# Altium project PCB_mezzanine_analog_template .PrjPCB
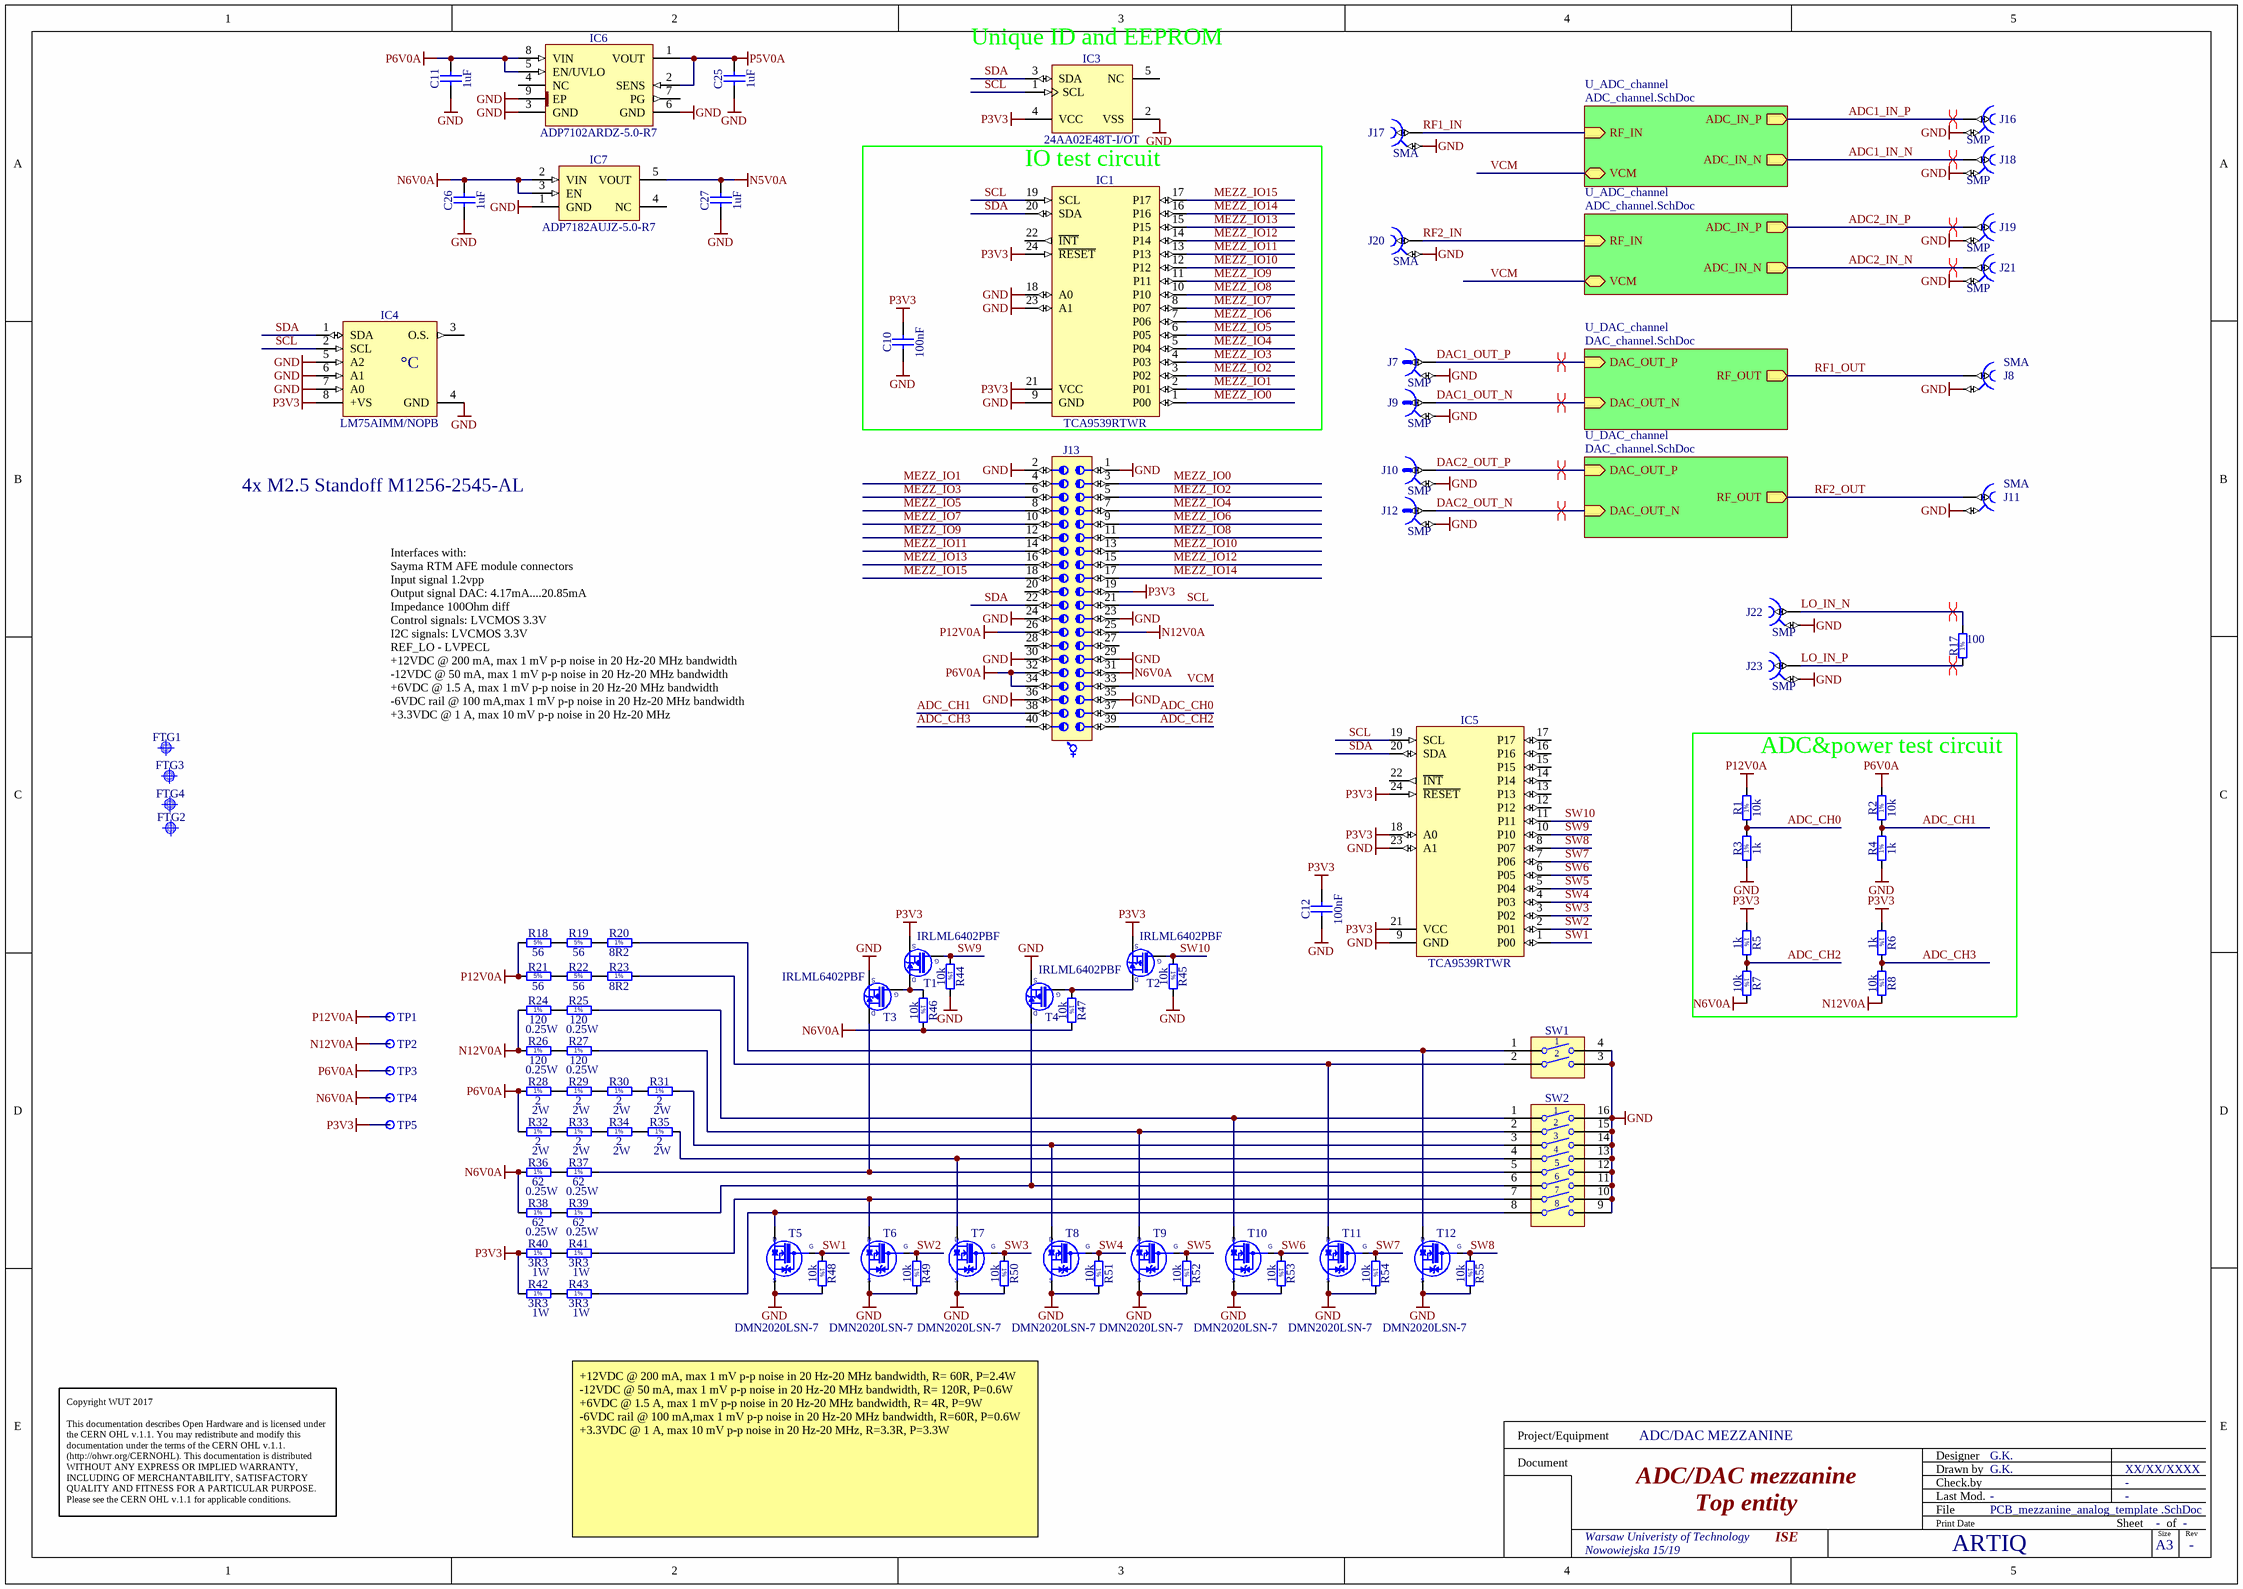
[diagram p0: PCB_mezzanine_analog_template .SchDoc]
3 sheets, 137 parts. Net scope: hierarchical (ports join the sheet entries above them; power ports are global).
Board file: PCB_mezzanine_analog_template.PcbDoc
Sheets:
  PCB_mezzanine_analog_template .SchDoc
    U_ADC_channel = ADC_channel.SchDoc
    U_DAC_channel = DAC_channel.SchDoc
    U_ADC_channel = ADC_channel.SchDoc
    U_DAC_channel = DAC_channel.SchDoc

## Sheet PCB_mezzanine_analog_template .SchDoc: ADC/DAC mezzanine
size 420 x 297 mm; Author: G.K.; CompanyName: WUT; DrawnBy: G.K.; Organization: CERN; Address1: Warsaw Univeristy of Technology; Address2: Nowowiejska 15/19; Revision: -; SheetNumber: -; SheetTotal: -; EDA_Number: ARTIQ; Projet: ADC/DAC MEZZANINE; ModifiedBy: -; CreateDate: XX/XX/XXXX; CheckedDate: -; Title2: Top entity; DivGrp: ISE; Designer: G.K.; ModifiedDate: -; ProjectName: ADC/DAC MEZZANINE

### Parts
C10  100nF  [CAPC1005X55N]
C11  1uF  [CAPC2012X140N]
C12  100nF  [CAPC1005X55N]
C25  1uF  [CAPC2012X140N]
C26  1uF  [CAPC2012X140N]
C27  1uF  [CAPC2012X140N]
FTG1  Use only in PCB  [FIDUCIAL_TOP_C100-200]  (value not drawn)
FTG2  Use only in PCB  [FIDUCIAL_TOP_S100-200]  (value not drawn)
FTG3  Use only in PCB  [FIDUCIAL_TOP_S100-200]  (value not drawn)
FTG4  Use only in PCB  [FIDUCIAL_TOP_S200-400]  (value not drawn)
IC1  TCA9539RTWR  [QFN50P400X400X80-25N-S255]
IC3  24AA02E48T-I/OT  [SOT95P280X145-5N]
IC4  LM75AIMM/NOPB  [SOP65P490X109-8N]
IC5  TCA9539RTWR  [QFN50P400X400X80-25N-S255]
IC6  ADP7102ARDZ-5.0-R7  [SOIC127P600X175-9N-R241X309]
IC7  ADP7182AUJZ-5.0-R7  [SOT95P280X90-5N]
J7  SMP  [MOLEX_85305-0232]
J8  SMA  [TELEGARTNER_J01151A0451]
J9  SMP  [MOLEX_85305-0232]
J10  SMP  [MOLEX_85305-0232]
J11  SMA  [TELEGARTNER_J01151A0451]
J12  SMP  [MOLEX_85305-0232]
J13  (no value)  [SAMTEC_LSS-120-02-L-DV-A]
J16  SMP  [AMPHENOL_SMP-MSLD-PCT-10]
J17  SMA  [TELEGARTNER_J01151A0921]
J18  SMP  [AMPHENOL_SMP-MSLD-PCT-10]
J19  SMP  [AMPHENOL_SMP-MSLD-PCT-10]
J20  SMA  [TELEGARTNER_J01151A0921]
J21  SMP  [AMPHENOL_SMP-MSLD-PCT-10]
J22  SMP  [AMPHENOL_SMP-MSLD-PCT-10]
J23  SMP  [AMPHENOL_SMP-MSLD-PCT-10]
R1  10k  [RESC1005X40N]
R2  10k  [RESC1005X40N]
R3  1k  [RESC1005X40N]
R4  1k  [RESC1005X40N]
R5  1k  [RESC1005X40N]
R6  1k  [RESC1005X40N]
R7  10k  [RESC1005X40N]
R8  10k  [RESC1005X40N]
R17  100  [RESC1005X40N]
R18  56  [RESC6331X70N]
R19  56  [RESC6331X70N]
R20  8R2  [RESC3216X65N]
R21  56  [RESC6331X70N]
R22  56  [RESC6331X70N]
R23  8R2  [RESC3216X65N]
R24  120  Power: 0.25W  [RESC3216X65N]
R25  120  Power: 0.25W  [RESC3216X65N]
R26  120  Power: 0.25W  [RESC3216X65N]
R27  120  Power: 0.25W  [RESC3216X65N]
R28  2  Power: 2W  [RESM11670X449N]
R29  2  Power: 2W  [RESM11670X449N]
R30  2  Power: 2W  [RESM11670X449N]
R31  2  Power: 2W  [RESM11670X449N]
R32  2  Power: 2W  [RESM11670X449N]
R33  2  Power: 2W  [RESM11670X449N]
R34  2  Power: 2W  [RESM11670X449N]
R35  2  Power: 2W  [RESM11670X449N]
R36  62  Power: 0.25W  [RESC3216X65N]
R37  62  Power: 0.25W  [RESC3216X65N]
R38  62  Power: 0.25W  [RESC3216X65N]
R39  62  Power: 0.25W  [RESC3216X65N]
R40  3R3  Power: 1W  [RESC6331X70N]
R41  3R3  Power: 1W  [RESC6331X70N]
R42  3R3  Power: 1W  [RESC6331X70N]
R43  3R3  Power: 1W  [RESC6331X70N]
R44  10k  [RESC1005X40N]
R45  10k  [RESC1005X40N]
R46  10k  [RESC1005X40N]
R47  10k  [RESC1005X40N]
R48  10k  [RESC1005X40N]
R49  10k  [RESC1005X40N]
R50  10k  [RESC1005X40N]
R51  10k  [RESC1005X40N]
R52  10k  [RESC1005X40N]
R53  10k  [RESC1005X40N]
R54  10k  [RESC1005X40N]
R55  10k  [RESC1005X40N]
SW1  Switch  [SW_OMRON_A6S-2102-H]  (value not drawn)
SW2  Switch  [SW_OMRON_A6S-8102-H]  (value not drawn)
T1  IRLML6402PBF  [SOT95P237X112-3N]
T2  IRLML6402PBF  [SOT95P237X112-3N]
T3  IRLML6402PBF  [SOT95P237X112-3N]
T4  IRLML6402PBF  [SOT95P237X112-3N]
T5  DMN2020LSN-7  [SOT95P285X140-3N]
T6  DMN2020LSN-7  [SOT95P285X140-3N]
T7  DMN2020LSN-7  [SOT95P285X140-3N]
T8  DMN2020LSN-7  [SOT95P285X140-3N]
T9  DMN2020LSN-7  [SOT95P285X140-3N]
T10  DMN2020LSN-7  [SOT95P285X140-3N]
T11  DMN2020LSN-7  [SOT95P285X140-3N]
T12  DMN2020LSN-7  [SOT95P285X140-3N]
TP1  Test Point  [TPS127]  (value not drawn)
TP2  Test Point  [TPS127]  (value not drawn)
TP3  Test Point  [TPS127]  (value not drawn)
TP4  Test Point  [TPS127]  (value not drawn)
TP5  Test Point  [TPS127]  (value not drawn)

### Blocks framed on the sheet
IO test circuit: C10 IC1
ADC&power test circuit: R1-R8

### Sub-sheets
U_ADC_channel = ADC_channel.SchDoc: ADC_IN_N (out), ADC_IN_P (out), RF_IN (in), VCM (bidir)
U_ADC_channel = ADC_channel.SchDoc: ADC_IN_P (out), ADC_IN_N (out), RF_IN (in), VCM (bidir)
U_DAC_channel = DAC_channel.SchDoc: DAC_OUT_P (in), DAC_OUT_N (in), RF_OUT (out)
U_DAC_channel = DAC_channel.SchDoc: DAC_OUT_P (in), DAC_OUT_N (in), RF_OUT (out)

### Nets
GND: C10.1 C11.1 C12.1 C25.1 C26.1 C27.1 IC1.9(GND) IC1.18(A0) IC1.23(A1) IC3.2(VSS) IC4.4(GND) IC4.5(A2) IC4.6(A1) IC4.7(A0) IC5.9(GND) IC5.23(A1) IC6.3(GND) IC6.6(GND) IC6.9(EP) IC7.1(GND) J7.2 J8.2 J9.2 J10.2 J11.2 J12.2 J13.1 J13.2 J13.23 J13.24 J13.29 J13.30 J13.35 J13.36 J16.2 J17.2 J18.2 J19.2 J20.2 J21.2 J22.2 J23.2 R3.1 R4.1 R44.2 R45.2 R48.2 R49.2 R50.2 R51.2 R52.2 R53.2 R54.2 R55.2 SW1.3 SW1.4 SW2.9 SW2.10 SW2.11 SW2.12 SW2.13 SW2.14 SW2.15 SW2.16 T3.2(S) T4.2(S) T5.2(S) T6.2(S) T7.2(S) T8.2(S) T9.2(S) T10.2(S) T11.2(S) T12.2(S)
N5V0A: C27.2 IC7.5(VOUT)
N6V0A: C26.2 IC7.2(VIN) IC7.3(EN) J13.31 R7.2 R36.1 R38.1 R46.2 R47.2 TP4.1
N12V0A: J13.25 R8.2 R24.1 R26.1 TP2.1
P3V3: C10.2 C12.2 IC1.21(VCC) IC1.24(~{RESET}) IC3.4(VCC) IC4.8(+VS) IC5.18(A0) IC5.21(VCC) IC5.24(~{RESET}) J13.19 R5.1 R6.1 R40.1 R42.1 T1.2(S) T2.2(S) TP5.1
P5V0A: C25.2 IC6.1(VOUT) IC6.2(SENS)
P6V0A: C11.2 IC6.5(EN/UVLO) IC6.8(VIN) J13.32 J13.34 R2.2 R28.1 R32.1 TP3.1
P12V0A: J13.26 R1.2 R18.1 R21.1 TP1.1
ADC1_IN_N: J18.1 ; sheet U_ADC_channel/ADC_IN_N
ADC1_IN_P: J16.1 ; sheet U_ADC_channel/ADC_IN_P
ADC2_IN_N: J21.1 ; sheet U_ADC_channel/ADC_IN_N
ADC2_IN_P: J19.1 ; sheet U_ADC_channel/ADC_IN_P
ADC_CH0: J13.37 R1.1 R3.2
ADC_CH1: J13.38 R2.1 R4.2
ADC_CH2: J13.39 R5.2 R7.1
ADC_CH3: J13.40 R6.2 R8.1
DAC1_OUT_N: J9.1 ; sheet U_DAC_channel/DAC_OUT_N
DAC1_OUT_P: J7.1 ; sheet U_DAC_channel/DAC_OUT_P
DAC2_OUT_N: J12.1 ; sheet U_DAC_channel/DAC_OUT_N
DAC2_OUT_P: J10.1 ; sheet U_DAC_channel/DAC_OUT_P
LO_IN_N: J22.1 R17.2
LO_IN_P: J23.1 R17.1
MEZZ_IO0: IC1.1(P00) J13.3
MEZZ_IO1: IC1.2(P01) J13.4
MEZZ_IO2: IC1.3(P02) J13.5
MEZZ_IO3: IC1.4(P03) J13.6
MEZZ_IO4: IC1.5(P04) J13.7
MEZZ_IO5: IC1.6(P05) J13.8
MEZZ_IO6: IC1.7(P06) J13.9
MEZZ_IO7: IC1.8(P07) J13.10
MEZZ_IO8: IC1.10(P10) J13.11
MEZZ_IO9: IC1.11(P11) J13.12
MEZZ_IO10: IC1.12(P12) J13.13
MEZZ_IO11: IC1.13(P13) J13.14
MEZZ_IO12: IC1.14(P14) J13.15
MEZZ_IO13: IC1.15(P15) J13.16
MEZZ_IO14: IC1.16(P16) J13.17
MEZZ_IO15: IC1.17(P17) J13.18
RF1_IN: J17.1 ; sheet U_ADC_channel/RF_IN
RF1_OUT: J8.1 ; sheet U_DAC_channel/RF_OUT
RF2_IN: J20.1 ; sheet U_ADC_channel/RF_IN
RF2_OUT: J11.1 ; sheet U_DAC_channel/RF_OUT
SCL: IC1.19(SCL) IC3.1(SCL) IC4.2(SCL) IC5.19(SCL) J13.21
SDA: IC1.20(SDA) IC3.3(SDA) IC4.1(SDA) IC5.20(SDA) J13.22
SW1: IC5.1(P00) R48.1 T5.1(G)
SW2: IC5.2(P01) R49.1 T6.1(G)
SW3: IC5.3(P02) R50.1 T7.1(G)
SW4: IC5.4(P03) R51.1 T8.1(G)
SW5: IC5.5(P04) R52.1 T9.1(G)
SW6: IC5.6(P05) R53.1 T10.1(G)
SW7: IC5.7(P06) R54.1 T11.1(G)
SW8: IC5.8(P07) R55.1 T12.1(G)
SW9: IC5.10(P10) R44.1 T1.1(G)
SW10: IC5.11(P11) R45.1 T2.1(G)
VCM: J13.33 ; sheet U_ADC_channel/VCM, sheet U_ADC_channel/VCM
NetR18_2: R18.2 R19.1
NetR19_2: R19.2 R20.1
NetR20_2: R20.2 SW1.1 T12.3(D)
NetR21_2: R21.2 R22.1
NetR22_2: R22.2 R23.1
NetR23_2: R23.2 SW1.2 T11.3(D)
NetR24_2: R24.2 R25.1
NetR25_2: R25.2 SW2.1 T10.3(D)
NetR26_2: R26.2 R27.1
NetR27_2: R27.2 SW2.2 T9.3(D)
NetR28_2: R28.2 R29.1
NetR29_2: R29.2 R30.1
NetR30_2: R30.2 R31.1
NetR31_2: R31.2 SW2.3 T8.3(D)
NetR32_2: R32.2 R33.1
NetR33_2: R33.2 R34.1
NetR34_2: R34.2 R35.1
NetR35_2: R35.2 SW2.4 T7.3(D)
NetR36_2: R36.2 R37.1
NetR37_2: R37.2 SW2.5 T3.3(D)
NetR38_2: R38.2 R39.1
NetR39_2: R39.2 SW2.6 T4.3(D)
NetR40_2: R40.2 R41.1
NetR41_2: R41.2 SW2.7 T6.3(D)
NetR42_2: R42.2 R43.1
NetR43_2: R43.2 SW2.8 T5.3(D)
NetR46_1: R46.1 T1.3(D) T3.1(G)
NetR47_1: R47.1 T2.3(D) T4.1(G)

Not connected (* = marked no-connect by the designer): IC1 22(~{INT}); IC3 5(NC); IC4 3(O.S.); IC5 12(P12) 13(P13) 14(P14) 15(P15) 16(P16) 17(P17) 22(~{INT}); IC6 4(NC) 7(PG); IC7 4(NC); J13 20 27 28

### Layout directives
differential pair: ADC1_IN_N, ADC1_IN_P, ADC2_IN_N, ADC2_IN_P, DAC1_OUT_N, DAC1_OUT_P, DAC2_OUT_N, DAC2_OUT_P, LO_IN_N, LO_IN_P

### Notes on the sheet
- (near IC3) Unique ID and EEPROM
- 4x M2.5 Standoff M1256-2545-AL
- Interfaces with:
  Sayma RTM AFE module connectors
  Input signal 1.2vpp
  Output signal DAC: 4.17mA....20.85mA
  Impedance 100Ohm diff
  Control signals: LVCMOS 3.3V
  I2C signals: LVCMOS 3.3V
  REF_LO - LVPECL
  +12VDC @ 200 mA, max 1 mV p-p noise in 20 Hz-20 MHz bandwidth
  -12VDC @ 50 mA, max 1 mV p-p noise in 20 Hz-20 MHz bandwidth
  +6VDC @ 1.5 A, max 1 mV p-p noise in 20 Hz-20 MHz bandwidth
  -6VDC rail @ 100 mA,max 1 mV p-p noise in 20 Hz-20 MHz bandwidth
  +3.3VDC @ 1 A, max 10 mV p-p noise in 20 Hz-20 MHz
- Copyright WUT 2017
  This documentation describes Open Hardware and is licensed under the CERN OHL v.1.1. You may redistribute and modify this documentation under the terms of the CERN OHL v.1.1. (http://ohwr.org/CERNOHL). This documentation is distributed WITHOUT ANY EXPRESS OR IMPLIED WARRANTY, INCLUDING OF MERCHANTABILITY, SATISFACTORY QUALITY AND FITNESS FOR A PARTICULAR PURPOSE. Please see the CERN OHL v.1.1 for applicable conditions.
- +12VDC @ 200 mA, max 1 mV p-p noise in 20 Hz-20 MHz bandwidth, R= 60R, P=2.4W
  -12VDC @ 50 mA, max 1 mV p-p noise in 20 Hz-20 MHz bandwidth, R= 120R, P=0.6W
  +6VDC @ 1.5 A, max 1 mV p-p noise in 20 Hz-20 MHz bandwidth, R= 4R, P=9W
  -6VDC rail @ 100 mA,max 1 mV p-p noise in 20 Hz-20 MHz bandwidth, R=60R, P=0.6W
  +3.3VDC @ 1 A, max 10 mV p-p noise in 20 Hz-20 MHz, R=3.3R, P=3.3W
- Project/Equipment
- Document
- Designer
- Drawn by
- Check.by
- File
- Last Mod.
- Print Date
- Sheet
- Size
- A3
- of
- Rev
- (in symbol LM75AIMM/NOPB) °C
- (in symbol R0402_1K_1%_0.0625W_100PPM) 1%
- (in symbol R0402_10K_1%_0.0625W_100PPM) 1%
- (in symbol R0402_100R_1%_0.0625W_100PPM) 1%
- (in symbol R1206_8R2_1%_0.25W_200PPM) 1%
- (in symbol R1206_62R_1%_0.25W_100PPM) 1%
- (in symbol R1206_120R_1%_0.25W_100PPM) 1%
- (in symbol R2512_3R3_1%_1W_200PPM) 1%
- (in symbol R2512_56R_5%_1W_200PPM) 5%
- (in symbol R4527_2R_1%_2W_50PPM) 1%

### Library data of the parts
C10 C12 = CC0402_100NF_16V_10%_X5R: Non-polarised capacitor; Part Description: SMD Multilayer Chip Ceramic Capacitor; Manufacturer: GENERIC; Manufacturer1 Part Number: GRM155R61C104KA88D; Voltage: 16V; TC: X5R; Tolerance: ±10%; Part Number: CC0402_100NF_16V_10%_X5R; Component Kind: Standard; Component Type: Standard; Pin Count: 2; Value: 100nF; Status: None; Manufacturer Part Number: CC0402_100NF_16V_10%_X5R; Case: 0402; Mounted: Yes; Socket: No; SMD: Yes; Sense: No; Manufacturer1 Example: MURATA; Manufacturer1 ComponentHeight: 0.55mm; HelpURL: \\cern.ch\dfs\Applications\Altium\Datasheets\CC0402_X5R_MURATA_GRM.pdf; Author: CERN DEM JLC; CreateDate: 10.12.2013; LatestRevisionDate: 10.12.2013
C11 C25-C27 = CC0805_1UF_35V_20%_X7R: Non-polarised capacitor; Part Description: SMD Multilayer Chip Ceramic Capacitor; Manufacturer: GENERIC; Manufacturer1 Part Number: GMK212B7105MG-T; Voltage: 35V; TC: X7R; Tolerance: ±20%; Part Number: CC0805_1UF_35V_20%_X7R; Component Kind: Standard; Component Type: Standard; Pin Count: 2; Value: 1uF; Status: Not Recommended; Manufacturer Part Number: CC0805_1UF_35V_20%_X7R; Case: 0805; Mounted: Yes; Socket: No; SMD: Yes; Sense: No; Manufacturer1 Example: TAIYO YUDEN; Manufacturer1 ComponentHeight: 1.35mm; HelpURL: \\cern.ch\dfs\Applications\Altium\Datasheets\CC0805_X7R_TAIYO-YUDEN_HIGH-VALUE.pdf; Author: CERN DEM JLC; CreateDate: 22.06.2011; LatestRevisionDate: 22.06.2011
FTG1 = FIDUCIAL_TARGET_C100-200: Fiducial Target; Part Description: Round Fiducial Target, Top Layer, 1.0mm, Top Solder 2.0mm, Keepout =2.0mm; Mounted: No; Part Number: FIDUCIAL_TARGET_C100-200; Component Kind: Standard (No BOM); Component Type: Standard (No BOM); Pin Count: 1; Family: Fiducial; Socket: No; SMD: Yes; Sense: No; Status: None; ComponentHeight: 0mm; HelpURL: Undefined; Author: CERN DEM JLC; CreateDate: 09.02.2010; LatestRevisionDate: 04.04.2012; PackageDescription: Round Fiducial Target, Top Layer, 1.0mm, Top Solder 2.0mm, Keepout =2.0mm
FTG2 FTG3 = FIDUCIAL_TARGET_S100-200: Fiducial Target; Part Description: Square Fiducial Target, Top Layer, 1.0mm, Top Solder 2.0mm, Keepout =2.0mm; Mounted: No; Part Number: FIDUCIAL_TARGET_S100-200; Component Kind: Standard (No BOM); Component Type: Standard (No BOM); Pin Count: 1; Family: Fiducial; Socket: No; SMD: Yes; Sense: No; Status: None; ComponentHeight: 0mm; HelpURL: Undefined; Author: CERN DEM JLC; CreateDate: 09.02.2010; LatestRevisionDate: 04.04.2012; PackageDescription: Square Fiducial Target, Top Layer, 1.0mm, Top Solder 2.0mm, Keepout =2.0mm
FTG4 = FIDUCIAL_TARGET_S200-400: Fiducial Target; Part Description: Square Fiducial Target, Top Layer, 2.0mm, Top Solder 4.0mm, Keepout =4.0mm; Mounted: No; Part Number: FIDUCIAL_TARGET_S200-400; Component Kind: Standard (No BOM); Component Type: Standard (No BOM); Pin Count: 1; Family: Fiducial; Socket: No; SMD: Yes; Sense: No; Status: None; ComponentHeight: 0mm; HelpURL: Undefined; Author: CERN DEM JLC; CreateDate: 02.06.2008; LatestRevisionDate: 04.04.2012; PackageDescription: Square Fiducial Target, Top Layer, 2.0mm, Top Solder 4.0mm, Keepout =4.0mm
IC1 IC5 = TCA9539RTWR: Low-Voltage 16-Bit I2C and SMBus I/O Expander; Part Description: Low Voltage 16-Bit I2C and SMBus Low-Power I/O Expander With Interrupt Output, Reset Pin, Configuration Registers; Manufacturer: TEXAS INSTRUMENTS; PressFit: No; Bonding: No; Part Number: TCA9539RTWR; Component Kind: Standard; Component Type: Standard; Device: TCA9539RTWR; PackageDescription: QFN, 0.50mm Pitch, Square; 24 Pin, 4.00mm X 4.00mm X 0.80mm H Body (w/Thermal Tab 2.55 X 2.55 mm), IPC Medium Density; Manufacturer Part Number: TCA9539RTWR; Pin Count: 25; Case: QFN24; Mounted: Yes; Socket: No; SMD: Yes; Sense: No; ComponentHeight: 0.8mm; Author: CERN DEM MR; HelpURL: \\cern.ch\dfs\Applications\Altium\Datasheets\TCA9539RTWR.pdf; CreateDate: 01.12.2015; LatestRevisionDate: 01.12.2015
IC3 = 24AA02E48T-I/OT: 1.7V-5.5V, 2K I2C Serial EEPROM With EUI-48 Node Identity; Manufacturer: MICROCHIP TECHNOLOGY; PressFit: No; Bonding: No; Part Number: 24AA02E48T-I/OT; Component Kind: Standard; Component Type: Standard; Device: 24AA02E48T-I/OT; PackageDescription: SOT, 0.95mm pitch; 5 pin, 1.60mm W X 2.90mm L X 1.45mm H body, IPC Medium Density; Part Description: 1.7V-5.5V, 2K I2C Serial EEPROM With EUI-48 Node Identity; Manufacturer Part Number: 24AA02E48T-I/OT; Pin Count: 5; Case: SOT23-5; Mounted: Yes; Socket: No; SMD: Yes; Sense: No; ComponentHeight: 1.45mm; HelpURL: \\cern.ch\dfs\Applications\Altium\Datasheets\24AA02E48T-I-OT.pdf; Author: CERN DEM MR; CreateDate: 31.03.2016; LatestRevisionDate: 31.03.2016
IC4 = LM75AIMM/NOPB: Digital Temperature Sensor and Thermal Watchdog with Two-Wire Interface; Part Description: -25° to +100°C ±2°C Digital Temperature Sensor and Thermal Watchdog with Two-Wire Interface; Manufacturer: TEXAS INSTRUMENTS; PressFit: No; Bonding: No; Part Number: LM75AIMM/NOPB; Component Kind: Standard; Component Type: Standard; Device: LM75AIMM/NOPB; PackageDescription: SOP, 0.65mm pitch; 8 pin,3.00mm W X 3.00mm L X 1.09mm H bodyI, PC Medium Density; Manufacturer Part Number: LM75AIMM/NOPB; Pin Count: 8; Case: SSOP8; Mounted: Yes; Socket: No; SMD: Yes; Sense: No; ComponentHeight: 1.09mm; HelpURL: \\cern.ch\dfs\Applications\Altium\Datasheets\LM75AIMM-NOPB.pdf; Author: CERN DEM JLC; CreateDate: 15.10.2012; LatestRevisionDate: 15.10.2012
IC6 = ADP7102ARDZ-5.0-R7: 300 mA, Low Noise, CMOS LDO Linear Regulator; Part Description: 5V, 300mA, Low Noise, CMOS LDO Linear Regulator; Manufacturer: ANALOG DEVICES; PressFit: No; Bonding: No; Part Number: ADP7102ARDZ-5.0-R7; Component Kind: Standard; Component Type: Standard; Device: ADP7102ARDZ-5.0-R7; PackageDescription: SOIC 8, Pitch 1.27mm - Body 3.9x4.9mm, (w/thermal tab 2.41mm X 3.098mm), IPC Medium Density; Manufacturer Part Number: ADP7102ARDZ-5.0-R7; Pin Count: 8; Case: SOIC8; Mounted: Yes; Socket: No; SMD: Yes; Sense: No; ComponentHeight: 1.75mm; HelpURL: \\cern.ch\dfs\Applications\Altium\Datasheets\ADP7102ARDZ-5.0-R7.pdf; Author: CERN DEM JLC; CreateDate: 17.03.2014; LatestRevisionDate: 17.03.2014
IC7 = ADP7182AUJZ-5.0-R7: –5V, 200 mA, Low Noise, Linear Regulator; Part Description: –5V, -200mA, Low Noise, Linear Regulator; Manufacturer: ANALOG DEVICES; PressFit: No; Bonding: No; Part Number: ADP7182AUJZ-5.0-R7; Component Kind: Standard; Component Type: Standard; Device: ADP7182AUJZ-5.0-R7; PackageDescription: SOT23, 0.95mm pitch; 5 pin, 1.75mm W X 3.00mm L, IPC Medium Density; Manufacturer Part Number: ADP7182AUJZ-5.0-R7; Pin Count: 5; Case: SOT23-5; Mounted: Yes; Socket: No; SMD: Yes; Sense: No; ComponentHeight: 0.9mm; HelpURL: \\cern.ch\dfs\Applications\Altium\Datasheets\ADP7182AUJZ-5.0-R7.pdf; Author: CERN DEM JLC; CreateDate: 17.03.2014; LatestRevisionDate: 17.03.2014
J7 J9 J10 J12 = MOLEX_85305-0232: Part Description: 50 Ohms, SMP Surface Mount Plug, Limited Detent; Manufacturer: MOLEX; PressFit: No; Part Number: MOLEX_85305-0232; Component Kind: Standard; Component Type: Standard; Pin Count: 2; Family: SMP; Mounted: Yes; Socket: No; SMD: Yes; Sense: No; Status: None; Manufacturer Part Number: 85305-0232; ComponentHeight: 4.1mm; HelpURL: \\cern.ch\dfs\Applications\Altium\Datasheets\MOLEX_85305-0232.pdf; Author: CERN DEM JMW; CreateDate: 09.08.2016; LatestRevisionDate: 09.08.2016
J8 J11 = TELEGARTNER_J01151A0451: Part Description: SMA 50 ohms Edge Mount Bulkhead Jack Receptacle; PressFit: No; Part Number: TELEGARTNER_J01151A0451; Component Kind: Standard; Component Type: Standard; Pin Count: 2; Family: SMA; Mounted: Yes; Socket: No; SMD: No; Sense: No; Status: None; Manufacturer: TELEGARTNER; Manufacturer Part Number: J01151A0451; ComponentHeight: 7mm; HelpURL: \\cern.ch\dfs\Applications\Altium\Datasheets\TELEGARTNER_J01151A0451.pdf; Author: CERN DEM JLC; CreateDate: 27.10.2016; LatestRevisionDate: 27.10.2016
J13 = CON_SAMTEC_LSS-120-02-L-DV-A: 40 Contacts, Pitch 0.635mm, Razor Beam LSS Vertical High Speed Hermaphroditic Strip (Lead Style 7.49mm); Part Description: 40 Contacts, Pitch 0.635mm, Razor Beam LSS Vertical High Speed Hermaphroditic Strip (Lead Style 5.49mm); Manufacturer: SAMTEC; PressFit: No; Part Number: SAMTEC_LSS-120-02-L-DV-A; Component Kind: Standard; Component Type: Standard; Pin Count: 40; Mounted: Yes; Socket: No; Sense: No; SMD: Yes; Status: None; Manufacturer Part Number: LSS-120-02-L-DV-A; ComponentHeight: 5.57mm; HelpURL: \\cern.ch\dfs\Applications\Altium\Datasheets\SAMTEC_LSS-120-03-L-DV-A.pdf; Author: CERN DEM JMW; CreateDate: 10.11.2015; LatestRevisionDate: 10.11.2015
J16 J18 J19 J21-J23 = AMPHENOL_SMP-MSLD-PCT-10: Part Description: 50 Ohm RF Connector, SMP Straight PCB Jack, Limited Detent, Surface Mount with Thru-Hole Contact; PressFit: No; Part Number: AMPHENOL_SMP-MSLD-PCT-10; Component Kind: Standard; Component Type: Standard; Pin Count: 2; Family: SMP; Mounted: Yes; Socket: No; SMD: Yes; Sense: No; Status: None; Manufacturer: AMPHENOL; Manufacturer Part Number: SMP-MSLD-PCT-10; ComponentHeight: 4.22mm; HelpURL: \\cern.ch\dfs\Applications\Altium\Datasheets\AMPHENOL_SMP-MSLD-PCT-10.pdf; Author: CERN DEM JLC; CreateDate: 05.12.2016; LatestRevisionDate: 05.12.2016
J17 J20 = TELEGARTNER_J01151A0921: Part Description: 50 Ohm SMA Right Angle PCB Jack; PressFit: No; Part Number: TELEGARTNER_J01151A0921; Component Kind: Standard; Component Type: Standard; Pin Count: 2; Family: SMA; Mounted: Yes; Socket: No; SMD: No; Sense: No; Status: None; Manufacturer: TELEGARTNER; Manufacturer Part Number: J01151A0921; ComponentHeight: 10.65mm; HelpURL: \\cern.ch\dfs\Applications\Altium\Datasheets\TELEGARTNER_J01151A0921.pdf; Author: CERN DEM JLC; CreateDate: 06.12.2016; LatestRevisionDate: 06.12.2016
R1 R2 R7 R8 R44-R55 = R0402_10K_1%_0.0625W_100PPM: Resistor - 1%; Part Description: General Purpose Thick Film Chip Resistor; Manufacturer: GENERIC; Manufacturer1 Part Number: 232270671003L; TC: ±100ppm/°C; Part Number: R0402_10K_1%_0.0625W_100PPM; Component Kind: Standard; Component Type: Standard; Pin Count: 2; Value: 10k; Status: Not recommended; Power: 0.0625W; Tolerance: ±1%; Manufacturer Part Number: R0402_10K_1%_0.0625W_100PPM; Case: 0402; Mounted: Yes; Sense: No; Socket: No; SMD: Yes; Manufacturer1 Example: YAGEO PHYCOMP; Manufacturer1 ComponentHeight: 0.4mm; HelpURL: \\cern.ch\dfs\Applications\Altium\Datasheets\R0402_Phycomp_RC0402.pdf; Author: CERN DEM JLC; CreateDate: 03.12.2007; LatestRevisionDate: 17.10.2012
R3-R6 = R0402_1K_1%_0.0625W_100PPM: Resistor - 1%; Part Description: General Purpose Thick Film Chip Resistor; Manufacturer: GENERIC; Manufacturer1 Part Number: 232270671002L; TC: ±100ppm/°C; Part Number: R0402_1K_1%_0.0625W_100PPM; Component Kind: Standard; Component Type: Standard; Pin Count: 2; Value: 1k; Status: Not recommended; Power: 0.0625W; Tolerance: ±1%; Manufacturer Part Number: R0402_1K_1%_0.0625W_100PPM; Case: 0402; Mounted: Yes; Sense: No; Socket: No; SMD: Yes; Manufacturer1 Example: YAGEO PHYCOMP; Manufacturer1 ComponentHeight: 0.4mm; HelpURL: \\cern.ch\dfs\Applications\Altium\Datasheets\R0402_Phycomp_RC0402.pdf; Author: CERN DEM JLC; CreateDate: 03.12.2007; LatestRevisionDate: 17.10.2012
R17 = R0402_100R_1%_0.0625W_100PPM: Resistor - 1%; Part Description: General Purpose Thick Film Chip Resistor; Manufacturer: GENERIC; Manufacturer1 Part Number: 232270671001L; TC: ±100ppm/°C; Part Number: R0402_100R_1%_0.0625W_100PPM; Component Kind: Standard; Component Type: Standard; Pin Count: 2; Value: 100; Status: Not recommended; Power: 0.0625W; Tolerance: ±1%; Manufacturer Part Number: R0402_100R_1%_0.0625W_100PPM; Case: 0402; Mounted: Yes; Sense: No; Socket: No; SMD: Yes; Manufacturer1 Example: YAGEO PHYCOMP; Manufacturer1 ComponentHeight: 0.4mm; HelpURL: \\cern.ch\dfs\Applications\Altium\Datasheets\R0402_Phycomp_RC0402.pdf; Author: CERN DEM JLC; CreateDate: 03.12.2007; LatestRevisionDate: 17.10.2012
R18 R19 R21 R22 = R2512_56R_5%_1W_200PPM: Resistor - 5%; Part Description: Surface Mount Power Resistor; Manufacturer: GENERIC; Manufacturer1 Part Number: 352056RJT; Power: 1W; TC: ±200ppm/°C; Part Number: R2512_56R_5%_1W_200PPM; Component Kind: Standard; Component Type: Standard; Pin Count: 2; Value: 56; Status: None; Tolerance: ±5%; Manufacturer Part Number: R2512_56R_5%_1W_200PPM; Case: 2512; Mounted: Yes; Sense: No; Socket: No; SMD: Yes; Manufacturer1 Example: TYCO ELECTRONICS; Manufacturer1 ComponentHeight: 0.7mm; HelpURL: \\cern.ch\dfs\Applications\Altium\Datasheets\R2512_TYCO_3520.pdf; Author: CERN DEM JLC; CreateDate: 21.07.2010; LatestRevisionDate: 21.07.2010
R20 R23 = R1206_8R2_1%_0.25W_200PPM: Resistor - 1%; Part Description: General Purpose Thick Film Chip Resistor; Manufacturer: GENERIC; Manufacturer1 Part Number: 232272468208; Power: 0.25W; TC: ±200ppm/°C; Part Number: R1206_8R2_1%_0.25W_200PPM; Component Kind: Standard; Component Type: Standard; Pin Count: 2; Value: 8R2; Status: Preferred; Tolerance: ±1%; Manufacturer Part Number: R1206_8R2_1%_0.25W_200PPM; Case: 1206; Mounted: Yes; Sense: No; Socket: No; SMD: Yes; Manufacturer1 Example: PHYCOMP; Manufacturer1 ComponentHeight: 0.65mm; HelpURL: \\cern.ch\dfs\Applications\Altium\Datasheets\R1206_Phycomp_RC1206.pdf; Author: CERN DEM JLC; CreateDate: 03.12.2007; LatestRevisionDate: 24.06.2009
R24-R27 = R1206_120R_1%_0.25W_100PPM: Resistor - 1%; Part Description: General Purpose Thick Film Chip Resistor; Manufacturer: GENERIC; Manufacturer1 Part Number: NRC12F1200TRF; TC: ±100ppm/°C; Part Number: R1206_120R_1%_0.25W_100PPM; Component Kind: Standard; Component Type: Standard; Pin Count: 2; Value: 120; Status: Preferred; Tolerance: ±1%; Manufacturer Part Number: R1206_120R_1%_0.25W_100PPM; Case: 1206; Mounted: Yes; Sense: No; Socket: No; SMD: Yes; Manufacturer1 Example: NIC COMPONENT; Manufacturer1 ComponentHeight: 0.65mm; HelpURL: \\cern.ch\dfs\Applications\Altium\Datasheets\R1206_NIC_NRC.pdf; Author: CERN DEM JLC; CreateDate: 03.12.2007; LatestRevisionDate: 13.03.2008
R28-R35 = R4527_2R_1%_2W_50PPM: Resistor - 1%; Part Description: Surface Mount Precision Power Wirewound Resistor; Manufacturer: VISHAY DALE; Manufacturer Part Number: WSC45272R000FEA; TC: ±50ppm/°C; Part Number: R4527_2R_1%_2W_50PPM; Component Kind: Standard; Component Type: Standard; Pin Count: 2; Value: 2; Status: None; Tolerance: ±1%; Case: 4527; Mounted: Yes; Sense: No; Socket: No; SMD: Yes; ComponentHeight: 4.49mm; HelpURL: \\cern.ch\dfs\Applications\Altium\Datasheets\R4527_VISHAY_WSC.pdf; Author: CERN DEM JLC; CreateDate: 22.03.2011; LatestRevisionDate: 22.03.2011
R36-R39 = R1206_62R_1%_0.25W_100PPM: Resistor - 1%; Part Description: General Purpose Thick Film Chip Resistor; Manufacturer: GENERIC; Manufacturer1 Part Number: NRC12F62R0TRF; TC: ±100ppm/°C; Part Number: R1206_62R_1%_0.25W_100PPM; Component Kind: Standard; Component Type: Standard; Pin Count: 2; Value: 62; Status: Preferred; Tolerance: ±1%; Manufacturer Part Number: R1206_62R_1%_0.25W_100PPM; Case: 1206; Mounted: Yes; Sense: No; Socket: No; SMD: Yes; Manufacturer1 Example: NIC COMPONENT; Manufacturer1 ComponentHeight: 0.65mm; HelpURL: \\cern.ch\dfs\Applications\Altium\Datasheets\R1206_NIC_NRC.pdf; Author: CERN DEM JLC; CreateDate: 03.12.2007; LatestRevisionDate: 13.03.2008
R40-R43 = R2512_3R3_1%_1W_200PPM: Resistor - 1%; Part Description: Thick Film Chip Resistor; Manufacturer: GENERIC; Manufacturer1 Part Number: 232276363308L or RC2512FK-073R3L; TC: ±200ppm/°C; Part Number: R2512_3R3_1%_1W_200PPM; Component Kind: Standard; Component Type: Standard; Pin Count: 2; Value: 3R3; Status: Preferred; Tolerance: ±1%; Manufacturer Part Number: R2512_3R3_1%_1W_200PPM; Case: 2512; Mounted: Yes; Sense: No; Socket: No; SMD: Yes; Manufacturer1 Example: YAGEO PHYCOMP; Manufacturer1 ComponentHeight: 0.65mm; HelpURL: \\cern.ch\dfs\Applications\Altium\Datasheets\R2512_Phycomp_RC2512.pdf; Author: CERN DEM JLC; CreateDate: 21.07.2008; LatestRevisionDate: 17.10.2012
SW1 = SW_OMRON_A6S-2102-H: 2 Ways SPST DIP Switch; Part Description: 2 Ways SPST DIP Switch, White Flat Actuator with Seal Tape, Contact Rating 25mA 24VDC; Manufacturer: OMRON; PressFit: No; Part Number: SW_OMRON_A6S-2102-H; Component Kind: Standard; Component Type: Standard; Pin Count: 4; PackageDescription: Pitch 2.54mm, Body 6.2x6.4mm, 2 Ways SPST Surface-Mounting DIP Switch, OMRON A6S-H; Family: Switch; Mounted: Yes; Socket: No; SMD: Yes; Sense: No; Status: None; Manufacturer Part Number: A6S-2102-H; ComponentHeight: 3.8mm; HelpURL: \\cern.ch\dfs\Applications\Altium\Datasheets\SW_OMRON_A6S-2102-H.pdf; Author: CERN DEM JMW; CreateDate: 25.09.2008; LatestRevisionDate: 25.09.2008
SW2 = SW_OMRON_A6S-8102-H: 8 Ways SPST DIP Switch; Part Description: 8 Ways SPST DIP Switch, White Flat Actuator with Seal Tape, Contact Rating 25mA 24VDC; Manufacturer: OMRON; PressFit: No; Part Number: SW_OMRON_A6S-8102-H; Component Kind: Standard; Component Type: Standard; Pin Count: 16; PackageDescription: Pitch 2.54mm, Body 21.5x6.4mm, 8 Ways SPST Surface-Mounting DIP Switch, OMRON A6S-H; Family: Switch; Mounted: Yes; Socket: No; SMD: Yes; Sense: No; Status: None; Manufacturer Part Number: A6S-8102-H; ComponentHeight: 3.8mm; HelpURL: \\cern.ch\dfs\Applications\Altium\Datasheets\SW_OMRON_A6S-8102-H.pdf; Author: CERN DEM JMW; CreateDate: 25.09.2008; LatestRevisionDate: 25.09.2008
T1-T4 = IRLML6402PBF: P-CHANNEL MOSFET WITH ZENER DIODE; Part Description: -20V -3.7A P-Channel HEXFET® Power MOSFET; Manufacturer: INTERNATIONAL RECTIFIER; PressFit: No; Bonding: No; Part Number: IRLML6402PBF; Component Kind: Standard; Component Type: Standard; Device: IRLML6402PBF; PackageDescription: SOT, 0.95mm, pitch; 3 pin,1.30mm W X 2.92mm L X 1.12mm H body, IPC Medium Density; Manufacturer Part Number: IRLML6402PBF; Pin Count: 3; Case: SOT23-3; Mounted: Yes; Socket: No; SMD: Yes; Sense: No; ComponentHeight: 1.12mm; HelpURL: \\cern.ch\dfs\Applications\Altium\Datasheets\IRLML6402PBF.pdf; Author: CERN DEM JLC; CreateDate: 29.08.2011; LatestRevisionDate: 29.08.2011
T5-T12 = DMN2020LSN-7: 20V, 6.9A, N-Channel Enhancement Mode MOSFET; Manufacturer: DIODES INCORPORATED; PressFit: No; Bonding: No; Part Number: DMN2020LSN-7; Component Kind: Standard; Component Type: Standard; Device: DMN2020LSN-7; PackageDescription: SOT23, 0.95mm Pitch; 3 Pin, 1.6mm W X 3mm L X 1.4mm H Body, IPC Medium Density; Part Description: 20V, 6.9A, N-Channel Enhancement Mode MOSFET; Manufacturer Part Number: DMN2020LSN-7; Pin Count: 3; Case: SOT23-3; Mounted: Yes; Socket: No; SMD: Yes; Sense: No; ComponentHeight: 1.15mm; HelpURL: \\cern.ch\dfs\Applications\Altium\Datasheets\DMN2020LSN-7.pdf; Author: CERN DEM JLC; CreateDate: 17.11.2014; LatestRevisionDate: 19.11.2014
TP1-TP5 = SMD_PAD_1.27X1.27MM: Part Description: 1.27mm x 1.27mm PCB Copper Area (SMD Test Point); Mounted: No; Part Number: SMD_PAD_1.27X1.27MM; Component Kind: Standard (No BOM); Component Type: Standard (No BOM); Pin Count: 1; Family: Test Point; Socket: No; SMD: Yes; Sense: No; Status: None; ComponentHeight: 0mm; HelpURL: Undefined; Author: CERN DEM JLC; CreateDate: 12.01.2008; LatestRevisionDate: 12.01.2008; PackageDescription: 1.27mm x 1.27mm PCB Copper Area (SMD Test Point)

## Sheet ADC_channel.SchDoc: ADC
size 420 x 297 mm; Author: G.K.; CompanyName: WUT; DrawnBy: G.K.; Organization: CERN; Address1: Warsaw Univeristy of Technology; Address2: Nowowiejska 15/19; Revision: -; SheetNumber: -; SheetTotal: -; EDA_Number: ARTIQ; Projet: ADC/DAC MEZZANINE; ModifiedBy: -; CreateDate: XX/XX/XXXX; CheckedDate: -; Title2: Input channel; DivGrp: ISE; Designer: G.K.; ModifiedDate: -; ProjectName: ADC/DAC MEZZANINE
Used 2 times, as channels U_ADC_channel, U_ADC_channel. Parts and nets are listed once, with the designators drawn on the sheet.
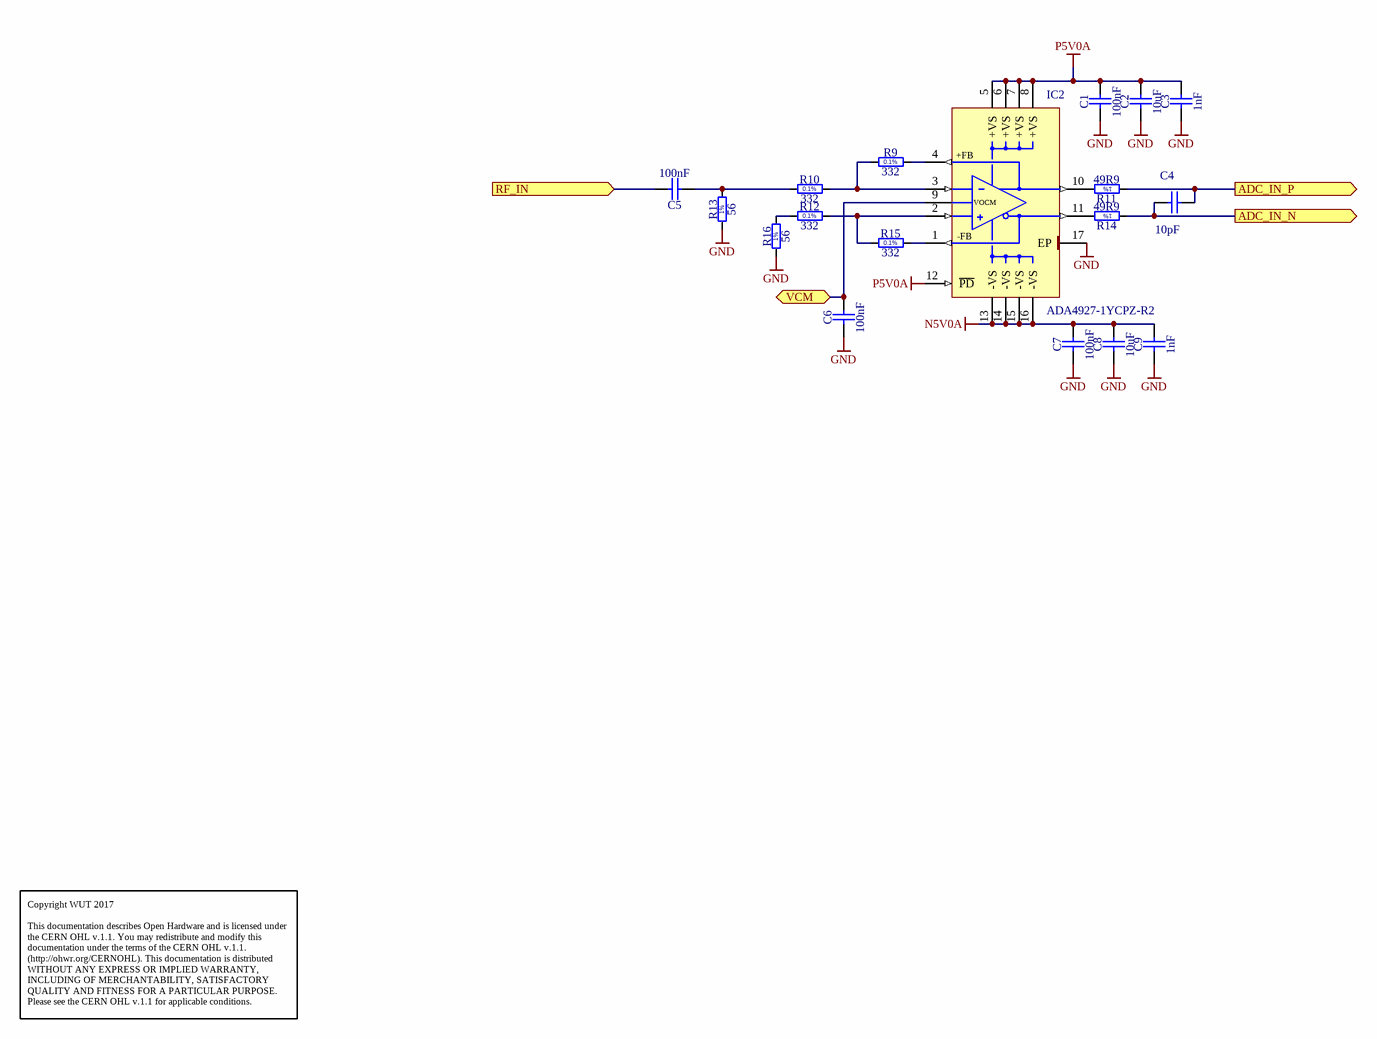
[diagram p1: ADC_channel.SchDoc]

### Parts
C1  100nF  [CAPC1005X55N]
C2  10uF  [CAPC1608X87N]
C3  1nF  [CAPC1005X55N]
C4  10pF  [CAPC1608X87N]
C5  100nF  [CAPC1005X55N]
C6  100nF  [CAPC1005X55N]
C7  100nF  [CAPC1005X55N]
C8  10uF  [CAPC1608X87N]
C9  1nF  [CAPC1005X55N]
IC2  ADA4927-1YCPZ-R2  [QFN50P300X300X100-17N-S145]
R9  332  [RESC1608X55N]
R10  332  [RESC1608X55N]
R11  49R9  [RESC1005X40N]
R12  332  [RESC1608X55N]
R13  56  [RESC1005X40N]
R14  49R9  [RESC1005X40N]
R15  332  [RESC1608X55N]
R16  56  [RESC1005X40N]

### Ports
ADC_IN_N (out), ADC_IN_P (out), RF_IN (in), VCM (bidir)

### Nets
GND: C1.1 C2.1 C3.1 C6.1 C7.1 C8.1 C9.1 IC2.17(EP) R13.1 R16.1
N5V0A: C7.2 C8.2 C9.2 IC2.13(-VS) IC2.14(-VS) IC2.15(-VS) IC2.16(-VS)
P5V0A: C1.2 C2.2 C3.2 IC2.5(+VS) IC2.6(+VS) IC2.7(+VS) IC2.8(+VS) IC2.12(~{PD})
ADC_IN_N: C4.1 R14.1 ; port ADC_IN_N
ADC_IN_P: C4.2 R11.1 ; port ADC_IN_P
RF_IN: C5.2 ; port RF_IN
VCM: C6.2 IC2.9(VOCM) ; port VCM
NetC5_1: C5.1 R10.1 R13.2
NetIC2_1: IC2.1(-FB) R15.2
NetIC2_2: IC2.2(+IN) R12.2 R15.1
NetIC2_3: IC2.3(-IN) R9.1 R10.2
NetIC2_4: IC2.4(+FB) R9.2
NetIC2_10: IC2.10(+OUT) R11.2
NetIC2_11: IC2.11(-OUT) R14.2
NetR12_1: R12.1 R16.2

### Channels
U_ADC_channel: designators end in B; ports ADC_IN_N=ADC1_IN_N ADC_IN_P=ADC1_IN_P RF_IN=RF1_IN VCM=VCM
U_ADC_channel: designators end in A; ports ADC_IN_N=ADC2_IN_N ADC_IN_P=ADC2_IN_P RF_IN=RF2_IN VCM=VCM

### Notes on the sheet
- Copyright WUT 2017
  This documentation describes Open Hardware and is licensed under the CERN OHL v.1.1. You may redistribute and modify this documentation under the terms of the CERN OHL v.1.1. (http://ohwr.org/CERNOHL). This documentation is distributed WITHOUT ANY EXPRESS OR IMPLIED WARRANTY, INCLUDING OF MERCHANTABILITY, SATISFACTORY QUALITY AND FITNESS FOR A PARTICULAR PURPOSE. Please see the CERN OHL v.1.1 for applicable conditions.
- Project/Equipment
- Designer
- Drawn by
- Check.by
- File
- Last Mod.
- Print Date
- Sheet
- Size
- A3
- of
- Rev
- (in symbol R0402_49R9_1%_0.0625W_100PPM) 1%
- (in symbol R0402_56R_1%_0.0625W_100PPM) 1%
- (in symbol R0603_332R_0.1%_0.063W_10PPM) 0.1%

### Library data of the parts
C1 C5-C7 = CC0402_100NF_16V_10%_X5R: as C10 on sheet PCB_mezzanine_analog_template ; Part Number: CC0402_100NF_16V_10%_X5R; Component Kind: Standard; Component Type: Standard; Pin Count: 2; Value: 100nF; Status: None; Manufacturer Part Number: CC0402_100NF_16V_10%_X5R; Case: 0402; Mounted: Yes; Socket: No; SMD: Yes; Sense: No; Manufacturer1 Example: MURATA; Manufacturer1 ComponentHeight: 0.55mm; HelpURL: \\cern.ch\dfs\Applications\Altium\Datasheets\CC0402_X5R_MURATA_GRM.pdf; Author: CERN DEM JLC; CreateDate: 10.12.2013; LatestRevisionDate: 10.12.2013
C2 C8 = CC0603_10UF_6.3V_20%_X5R: Non-polarised capacitor; Part Description: SMD Multilayer Chip Ceramic Capacitor; Manufacturer: GENERIC; Manufacturer1 Part Number: C0603C106M9PAC; Voltage: 6.3V; TC: X5R; Tolerance: ±20%; Part Number: CC0603_10UF_6.3V_20%_X5R; Component Kind: Standard; Component Type: Standard; Pin Count: 2; Value: 10uF; Status: Preferred; Manufacturer Part Number: CC0603_10uF_6.3V_20%_X5R; Case: 0603; Mounted: Yes; Socket: No; SMD: Yes; Sense: No; Manufacturer1 Example: KEMET; Manufacturer1 ComponentHeight: 0.95mm; HelpURL: \\cern.ch\dfs\Applications\Altium\Datasheets\CC0603_X5R_KEMET.pdf; Author: CERN DEM JLC; CreateDate: 03.12.2007; LatestRevisionDate: 03.12.2007
C3 C9 = CC0402_1NF_50V_10%_X7R: Non-polarised capacitor; Part Description: SMD Multilayer Chip Ceramic Capacitor; Manufacturer: GENERIC; Manufacturer1 Part Number: 223858715623; Voltage: 50V; TC: X7R; Tolerance: ±10%; Part Number: CC0402_1NF_50V_10%_X7R; Component Kind: Standard; Component Type: Standard; Pin Count: 2; Value: 1nF; Status: Not Recommended; Manufacturer Part Number: CC0402_1NF_50V_10%_X7R; Case: 0402; Mounted: Yes; Socket: No; SMD: Yes; Sense: No; Manufacturer1 Example: PHYCOMP; Manufacturer1 ComponentHeight: 0.55mm; HelpURL: \\cern.ch\dfs\Applications\Altium\Datasheets\CC0402_X7R_PHYCOMP.pdf; Author: CERN DEM JLC; CreateDate: 03.12.2007; LatestRevisionDate: 03.12.2007
C4 = CC0603_10PF_50V_5%_NP0: Non-polarised capacitor; Part Description: SMD Multilayer Chip Ceramic Capacitor; Manufacturer: GENERIC; Manufacturer1 Part Number: 223886715109; Voltage: 50V; TC: C0G/NP0; Tolerance: ±5%; Part Number: CC0603_10PF_50V_5%_NP0; Component Kind: Standard; Component Type: Standard; Pin Count: 2; Value: 10pF; Status: Preferred; Manufacturer Part Number: CC0603_10PF_50V_5%_NP0; Case: 0603; Mounted: Yes; Socket: No; SMD: Yes; Sense: No; Manufacturer1 Example: PHYCOMP; Manufacturer1 ComponentHeight: 0.87mm; HelpURL: \\cern.ch\dfs\Applications\Altium\Datasheets\CC0603_NP0_PHYCOMP.pdf; Author: CERN DEM JLC; CreateDate: 03.12.2007; LatestRevisionDate: 03.12.2007
IC2 = ADA4927-1YCPZ-R2: Ultralow Distortion Current Feedback Differential ADC Driver; Manufacturer: ANALOG DEVICES; PressFit: No; Bonding: No; Part Number: ADA4927-1YCPZ-R2; Component Kind: Standard; Component Type: Standard; Device: ADA4927-1YCPZ-R2; PackageDescription: QFN,0.50mm pitch,square; 4 pin X 4 pin, 3mm X 3mm X 1.00mm H body (w/thermal tab 1.45 X 1.45mm),  IPC Medium Density; Part Description: Ultralow Distortion Current Feedback Differential ADC Driver; Manufacturer Part Number: ADA4927-1YCPZ-R2; Pin Count: 17; Case: QFN16; Mounted: Yes; Socket: No; SMD: Yes; Sense: No; ComponentHeight: 1mm; Author: CERN DEM JLC; HelpURL: \\cern.ch\dfs\Applications\Altium\Datasheets\ADA4927-1YCPZ-R2.pdf; CreateDate: 19.04.2010; LatestRevisionDate: 19.04.2010
R9 R10 R12 R15 = R0603_332R_0.1%_0.063W_10PPM: Resistor - 0.1%; Part Description: Thin Film Chip Resistor; Manufacturer: GENERIC; Manufacturer1 Part Number: RN73C1J332RBTDF; Power: 0.063W; TC: ±10ppm; Part Number: R0603_332R_0.1%_0.063W_10PPM; Component Kind: Standard; Component Type: Standard; Pin Count: 2; Value: 332; Status: Not recommended; Tolerance: ±0.1%; Manufacturer Part Number: R0603_332R_0.1%_0.063W_10PPM; Case: 0603; Mounted: Yes; Sense: No; Socket: No; SMD: Yes; Manufacturer1 Example: TYCO HOLSWORTHY; Manufacturer1 ComponentHeight: 0.5mm; HelpURL: \\cern.ch\dfs\Applications\Altium\Datasheets\R0603_Tyco_RN73.pdf; Author: CERN DEM JLC; CreateDate: 03.12.2007; LatestRevisionDate: 13.03.2008
R11 R14 = R0402_49R9_1%_0.0625W_100PPM: Resistor - 1%; Part Description: General Purpose Thick Film Chip Resistor; Manufacturer: GENERIC; Manufacturer1 Part Number: 232270674999L or RC0402FR-0749R9L; TC: ±100ppm/°C; Part Number: R0402_49R9_1%_0.0625W_100PPM; Component Kind: Standard; Component Type: Standard; Pin Count: 2; Value: 49R9; Status: Not recommended; Power: 0.0625W; Tolerance: ±1%; Manufacturer Part Number: R0402_49R9_1%_0.0625W_100PPM; Case: 0402; Mounted: Yes; Sense: No; Socket: No; SMD: Yes; Manufacturer1 Example: YAGEO PHYCOMP; Manufacturer1 ComponentHeight: 0.4mm; HelpURL: \\cern.ch\dfs\Applications\Altium\Datasheets\R0402_Phycomp_RC0402.pdf; Author: CERN DEM JLC; CreateDate: 24.10.2012; LatestRevisionDate: 24.10.2012
R13 R16 = R0402_56R_1%_0.0625W_100PPM: Resistor - 1%; Part Description: General Purpose Thick Film Chip Resistor; Manufacturer: GENERIC; Manufacturer1 Part Number: 232270675609L; TC: ±100ppm/°C; Part Number: R0402_56R_1%_0.0625W_100PPM; Component Kind: Standard; Component Type: Standard; Pin Count: 2; Value: 56; Status: Not recommended; Power: 0.0625W; Tolerance: ±1%; Manufacturer Part Number: R0402_56R_1%_0.0625W_100PPM; Case: 0402; Mounted: Yes; Sense: No; Socket: No; SMD: Yes; Manufacturer1 Example: YAGEO PHYCOMP; Manufacturer1 ComponentHeight: 0.4mm; HelpURL: \\cern.ch\dfs\Applications\Altium\Datasheets\R0402_Phycomp_RC0402.pdf; Author: CERN DEM JLC; CreateDate: 03.12.2007; LatestRevisionDate: 17.10.2012

## Sheet DAC_channel.SchDoc: DAC
size 420 x 297 mm; Author: G.K.; CompanyName: WUT; DrawnBy: G.K.; Organization: CERN; Address1: Warsaw Univeristy of Technology; Address2: Nowowiejska 15/19; Revision: -; SheetNumber: -; SheetTotal: -; EDA_Number: ARTIQ; Projet: ADC/DAC MEZZANINE; ModifiedBy: -; CreateDate: XX/XX/XXXX; CheckedDate: -; Title2: Output channel; DivGrp: ISE; Designer: G.K.; ModifiedDate: -; ProjectName: ADC/DAC MEZZANINE
Used 2 times, as channels U_DAC_channel, U_DAC_channel. Parts and nets are listed once, with the designators drawn on the sheet.
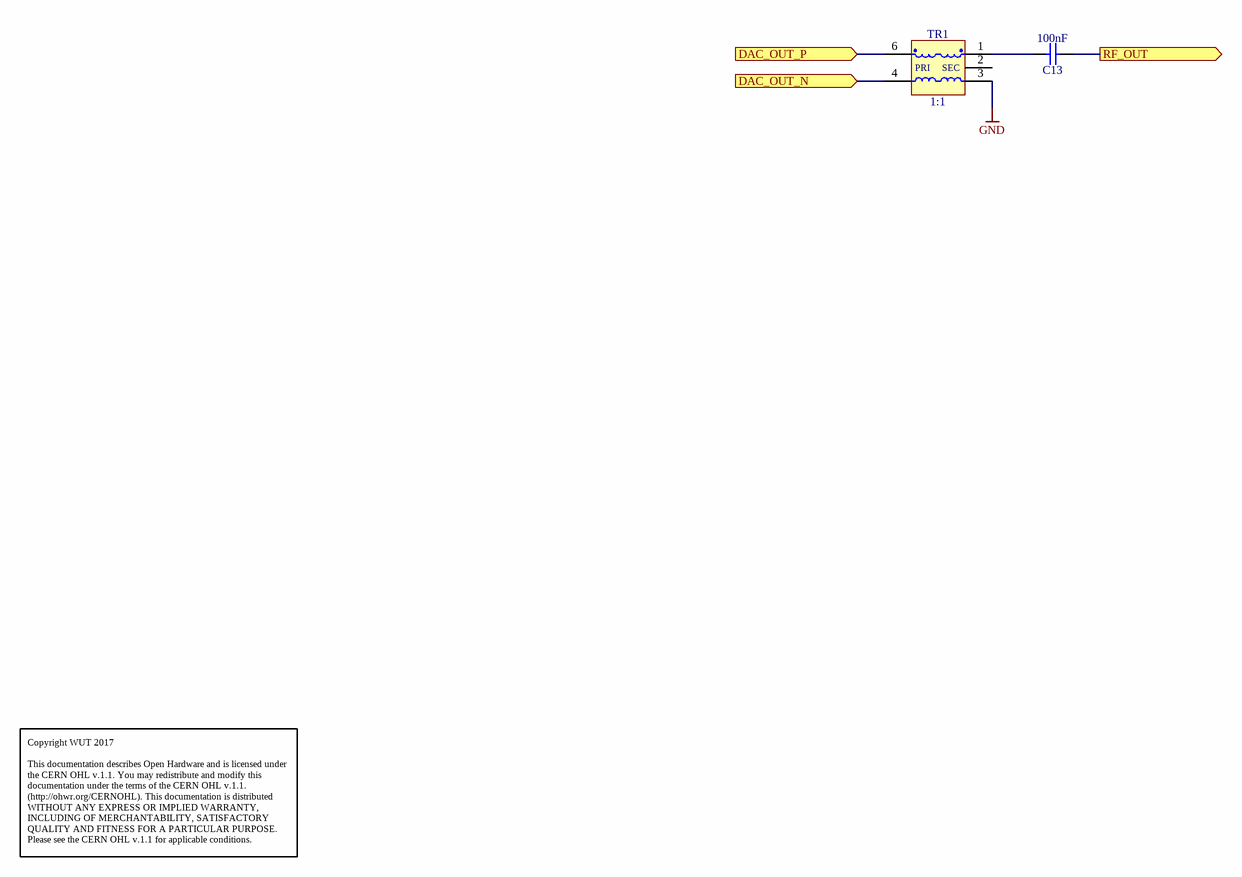
[diagram p2: DAC_channel.SchDoc]

### Parts
C13  100nF  [CAPC1608X87N]
TR1  1:1  [XFMR_MINI-CIRCUITS_AT224]

### Ports
DAC_OUT_N (in), DAC_OUT_P (in), RF_OUT (out)

### Nets
GND: TR1.3(S)
DAC_OUT_N: TR1.4(P) ; port DAC_OUT_N
DAC_OUT_P: TR1.6(PDOT) ; port DAC_OUT_P
RF_OUT: C13.1 ; port RF_OUT
NetC13_2: C13.2 TR1.1(SDOT)

Not connected (* = marked no-connect by the designer): TR1 2(NC)

### Channels
U_DAC_channel: designators end in B; ports DAC_OUT_N=DAC1_OUT_N DAC_OUT_P=DAC1_OUT_P RF_OUT=RF1_OUT
U_DAC_channel: designators end in A; ports DAC_OUT_N=DAC2_OUT_N DAC_OUT_P=DAC2_OUT_P RF_OUT=RF2_OUT

### Notes on the sheet
- Copyright WUT 2017
  This documentation describes Open Hardware and is licensed under the CERN OHL v.1.1. You may redistribute and modify this documentation under the terms of the CERN OHL v.1.1. (http://ohwr.org/CERNOHL). This documentation is distributed WITHOUT ANY EXPRESS OR IMPLIED WARRANTY, INCLUDING OF MERCHANTABILITY, SATISFACTORY QUALITY AND FITNESS FOR A PARTICULAR PURPOSE. Please see the CERN OHL v.1.1 for applicable conditions.
- Project/Equipment
- Designer
- Drawn by
- Check.by
- File
- Last Mod.
- Print Date
- Sheet
- Size
- A3
- of
- Rev
- (in symbol XFMR_MINI-CIRCUITS_TC1-1-13M+) PRI; SEC

### Library data of the parts
C13 = CC0603_100NF_50V_10%_X7R: Non-polarised capacitor; Part Description: SMD Multilayer Chip Ceramic Capacitor; Manufacturer: GENERIC; Manufacturer1 Part Number: 223858615649; Voltage: 50V; TC: X7R; Tolerance: ±10%; Part Number: CC0603_100NF_50V_10%_X7R; Component Kind: Standard; Component Type: Standard; Pin Count: 2; Value: 100nF; Status: Preferred; Manufacturer Part Number: CC0603_100NF_50V_10%_X7R; Case: 0603; Mounted: Yes; Socket: No; SMD: Yes; Sense: No; Manufacturer1 Example: PHYCOMP; Manufacturer1 ComponentHeight: 0.87mm; HelpURL: \\cern.ch\dfs\Applications\Altium\Datasheets\CC0603_X7R_PHYCOMP.pdf; Author: CERN DEM JLC; CreateDate: 03.12.2007; LatestRevisionDate: 03.12.2007
TR1 = XFMR_MINI-CIRCUITS_TC1-1-13M+: 50 Ohms 4.5 To 3000MHz RF Transformers; Part Number: XFMR_MINI-CIRCUITS_TC1-1-13M+; Component Kind: Standard; Component Type: Standard; Pin Count: 5; Value: 1:1; Status: None; Part Description: 50 Ohms 4.5 To 3000MHz RF Transformer; Manufacturer: MINI-CIRCUITS; Manufacturer Part Number: TC1-1-13M+; Mounted: Yes; Socket: No; Sense: No; SMD: Yes; ComponentHeight: 3.81mm; HelpURL: \\cern.ch\dfs\Applications\Altium\Datasheets\XFMR_MINI-CIRCUITS_TC1-1-13M+.pdf; Author: CERN DEM JLC; CreateDate: 30.11.2011; LatestRevisionDate: 30.11.2011

## Nets that join several sheets
GND: PCB_mezzanine_analog_template  (74 pins), U_ADC_channel (10 pins), U_DAC_channel (TR1B.3), U_ADC_channel (10 pins), U_DAC_channel (TR1A.3)
N5V0A: PCB_mezzanine_analog_template  (C27.2 IC7.5), U_ADC_channel (7 pins), U_ADC_channel (7 pins)
P5V0A: PCB_mezzanine_analog_template  (C25.2 IC6.1 IC6.2), U_ADC_channel (8 pins), U_ADC_channel (8 pins)
ADC1_IN_N: PCB_mezzanine_analog_template  (J18.1), U_ADC_channel (C4B.1 R14B.1)
ADC1_IN_P: PCB_mezzanine_analog_template  (J16.1), U_ADC_channel (C4B.2 R11B.1)
ADC2_IN_N: PCB_mezzanine_analog_template  (J21.1), U_ADC_channel (C4A.1 R14A.1)
ADC2_IN_P: PCB_mezzanine_analog_template  (J19.1), U_ADC_channel (C4A.2 R11A.1)
DAC1_OUT_N: PCB_mezzanine_analog_template  (J9.1), U_DAC_channel (TR1B.4)
DAC1_OUT_P: PCB_mezzanine_analog_template  (J7.1), U_DAC_channel (TR1B.6)
DAC2_OUT_N: PCB_mezzanine_analog_template  (J12.1), U_DAC_channel (TR1A.4)
DAC2_OUT_P: PCB_mezzanine_analog_template  (J10.1), U_DAC_channel (TR1A.6)
RF1_IN: PCB_mezzanine_analog_template  (J17.1), U_ADC_channel (C5B.2)
RF1_OUT: PCB_mezzanine_analog_template  (J8.1), U_DAC_channel (C13B.1)
RF2_IN: PCB_mezzanine_analog_template  (J20.1), U_ADC_channel (C5A.2)
RF2_OUT: PCB_mezzanine_analog_template  (J11.1), U_DAC_channel (C13A.1)
VCM: PCB_mezzanine_analog_template  (J13.33), U_ADC_channel (C6B.2 IC2B.9), U_ADC_channel (C6A.2 IC2A.9)